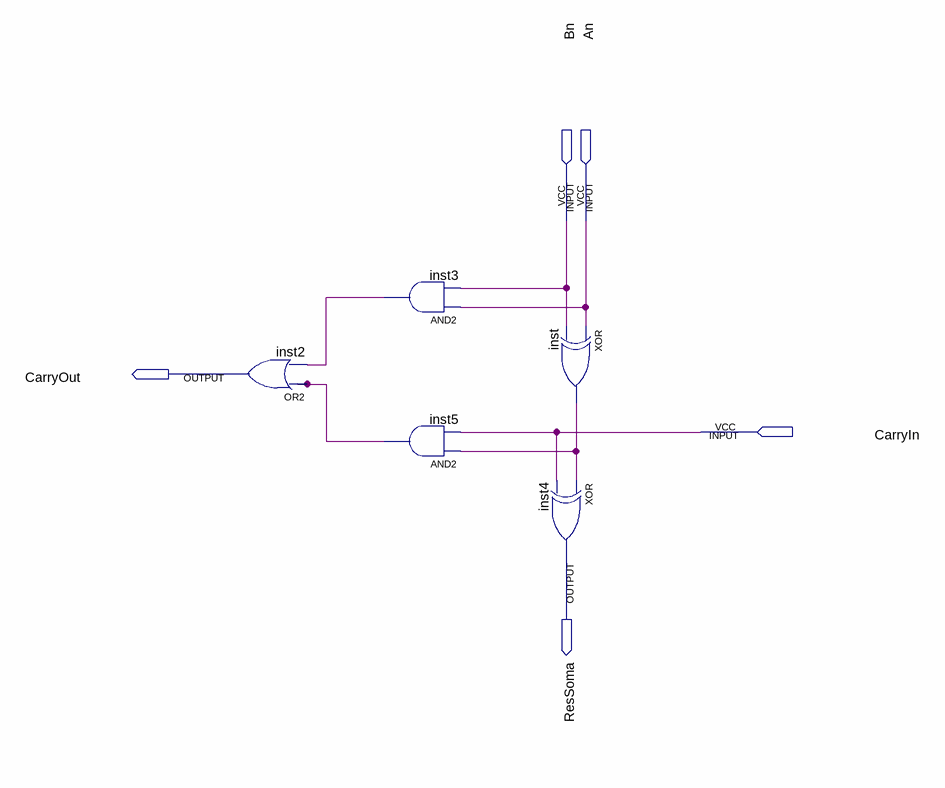
[diagram p0: schematic sheet]
// Quartus schematic SomadorCompleto.bdf as structural Verilog: 5 symbols, 5 pins
module SomadorCompleto (
  input  Bn,
  input  An,
  input  CarryIn,
  output CarryOut,
  output ResSoma
);

  wire inst3_out, inst5_out, inst_out;

  or inst2 (CarryOut, inst5_out, inst3_out);
  and inst3 (inst3_out, An, Bn);
  and inst5 (inst5_out, inst_out, CarryIn);
  xor inst (inst_out, An, Bn);
  xor inst4 (ResSoma, inst_out, CarryIn);
endmodule
